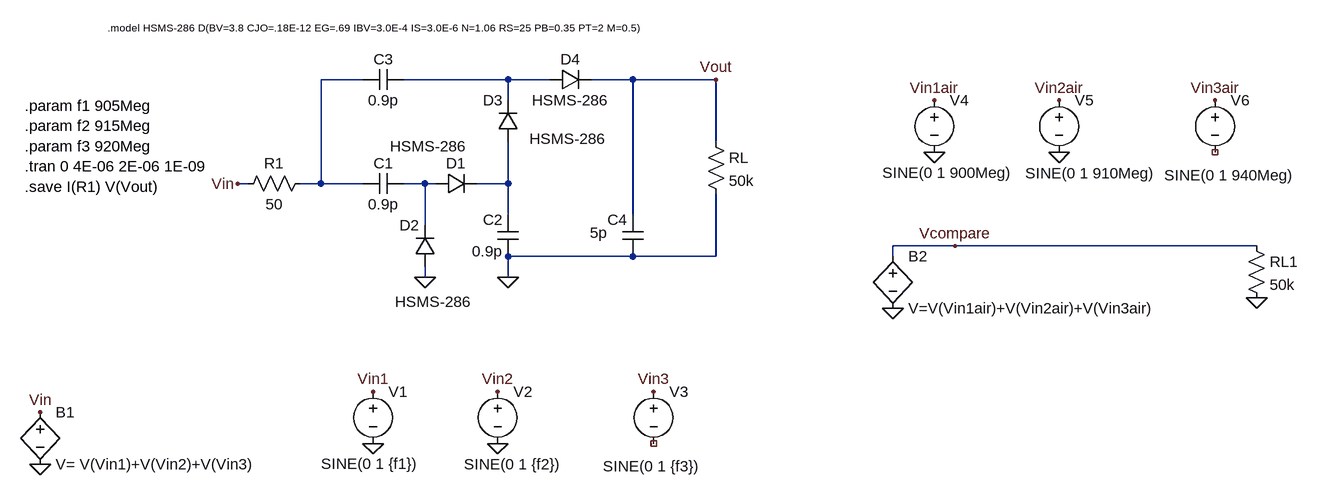
[diagram p0: schematic voltage_multiplier_2stage.asc]
voltage_multiplier_2stage.asc, the LTspice schematic file:
Version 4
SHEET 1 1536 736
WIRE 80 112 16 112
WIRE 304 112 144 112
WIRE 368 112 304 112
WIRE 496 112 432 112
WIRE 624 112 496 112
WIRE 304 144 304 112
WIRE 624 208 624 112
WIRE -96 272 -112 272
WIRE 16 272 16 112
WIRE 16 272 -16 272
WIRE 80 272 16 272
WIRE 176 272 144 272
WIRE 192 272 176 272
WIRE 304 272 304 208
WIRE 304 272 256 272
WIRE 304 320 304 272
WIRE 496 320 496 112
WIRE 176 336 176 272
WIRE 992 368 896 368
WIRE 1456 368 992 368
WIRE 496 384 304 384
WIRE 624 384 624 288
WIRE 624 384 496 384
WIRE 896 384 896 368
WIRE 176 416 176 400
WIRE 304 416 304 384
FLAG 304 416 0
FLAG 176 416 0
FLAG 96 592 Vin1
FLAG -112 272 Vin
FLAG 96 672 0
FLAG 288 672 0
FLAG -416 704 0
FLAG 288 592 Vin2
FLAG 528 592 Vin3
FLAG -416 624 Vin
FLAG 624 112 Vout
FLAG 960 144 Vin1air
FLAG 960 224 0
FLAG 1152 224 0
FLAG 1152 144 Vin2air
FLAG 1392 144 Vin3air
FLAG 896 464 0
FLAG 1456 448 0
FLAG 992 368 Vcompare
SYMBOL res 608 192 R0
SYMATTR InstName RL
SYMATTR Value 50k
SYMBOL cap 144 256 R90
WINDOW 0 0 32 VBottom 2
WINDOW 3 32 32 VTop 2
SYMATTR InstName C1
SYMATTR Value 0.9p
SYMBOL cap 320 384 R180
WINDOW 0 24 56 Left 2
WINDOW 3 24 8 Left 2
SYMATTR InstName C2
SYMATTR Value 0.9p
SYMBOL diode 192 288 R270
WINDOW 0 32 32 VTop 2
WINDOW 3 89 -11 VBottom 2
SYMATTR InstName D1
SYMATTR Value HSMS-286
SYMBOL diode 192 400 R180
WINDOW 0 24 64 Left 2
WINDOW 3 -56 -54 Left 2
SYMATTR InstName D2
SYMATTR Value HSMS-286
SYMBOL voltage 96 576 R0
WINDOW 3 -80 127 Left 2
SYMATTR Value SINE(0 1 {f1})
SYMATTR InstName V1
SYMBOL cap 144 96 R90
WINDOW 0 0 32 VBottom 2
WINDOW 3 32 32 VTop 2
SYMATTR InstName C3
SYMATTR Value 0.9p
SYMBOL cap 512 384 R180
WINDOW 0 24 56 Left 2
WINDOW 3 55 36 Left 2
SYMATTR InstName C4
SYMATTR Value 5p
SYMBOL diode 320 208 R180
WINDOW 0 24 64 Left 2
WINDOW 3 -135 5 Left 2
SYMATTR InstName D3
SYMATTR Value HSMS-286
SYMBOL diode 368 128 R270
WINDOW 0 32 32 VTop 2
WINDOW 3 0 32 VBottom 2
SYMATTR InstName D4
SYMATTR Value HSMS-286
SYMBOL voltage 288 576 R0
WINDOW 3 -52 128 Left 2
SYMATTR Value SINE(0 1 {f2})
SYMATTR InstName V2
SYMBOL bv -416 608 R0
SYMATTR InstName B1
SYMATTR Value V= V(Vin1)+V(Vin2)+V(Vin3)
SYMBOL voltage 528 576 R0
WINDOW 3 -78 131 Left 2
SYMATTR Value SINE(0 1 {f3})
SYMATTR InstName V3
SYMBOL bv 896 368 R0
SYMATTR InstName B2
SYMATTR Value V=V(Vin1air)+V(Vin2air)+V(Vin3air)
SYMBOL voltage 960 128 R0
WINDOW 3 -80 127 Left 2
SYMATTR Value SINE(0 1 900Meg)
SYMATTR InstName V4
SYMBOL voltage 1152 128 R0
WINDOW 3 -52 128 Left 2
SYMATTR Value SINE(0 1 910Meg)
SYMATTR InstName V5
SYMBOL voltage 1392 128 R0
WINDOW 3 -78 131 Left 2
SYMATTR Value SINE(0 1 940Meg)
SYMATTR InstName V6
SYMBOL res 1440 352 R0
SYMATTR InstName RL1
SYMATTR Value 50k
SYMBOL res 0 256 R90
WINDOW 0 0 56 VBottom 2
WINDOW 3 32 56 VTop 2
SYMATTR InstName R1
SYMATTR Value 50
TEXT -440 152 Left 2 !.param f1 905Meg\n.param f2 915Meg\n.param f3 920Meg\n.tran 0 4E-06 2E-06 1E-09\n.save I(R1) V(Vout)
TEXT -312 32 Left 1 !.model HSMS-286 D(BV=3.8 CJO=.18E-12 EG=.69 IBV=3.0E-4 IS=3.0E-6 N=1.06 RS=25 PB=0.35 PT=2 M=0.5)

The netlist it stands for:
* voltage_multiplier_2stage.asc
RL Vout 0 50k
C1 N003 N001 0.9p
C2 0 N004 0.9p
D1 N003 N004 HSMS-286
D2 0 N003 HSMS-286
V1 Vin1 0 SINE(0 1 {f1})
C3 N002 N001 0.9p
C4 0 Vout 5p
D3 N004 N002 HSMS-286
D4 N002 Vout HSMS-286
V2 Vin2 0 SINE(0 1 {f2})
B1 Vin 0 V= V(Vin1)+V(Vin2)+V(Vin3)
V3 Vin3 NC_01 SINE(0 1 {f3})
B2 Vcompare 0 V=V(Vin1air)+V(Vin2air)+V(Vin3air)
V4 Vin1air 0 SINE(0 1 900Meg)
V5 Vin2air 0 SINE(0 1 910Meg)
V6 Vin3air NC_02 SINE(0 1 940Meg)
RL1 Vcompare 0 50k
R1 N001 Vin 50
.model D D
.lib standard.dio
.param f1 905Meg
.param f2 915Meg
.param f3 920Meg
.tran 0 4E-06 2E-06 1E-09
.save I(R1) V(Vout)
.model HSMS-286 D(BV=3.8 CJO=.18E-12 EG=.69 IBV=3.0E-4 IS=3.0E-6 N=1.06 RS=25 PB=0.35 PT=2 M=0.5)
.backanno
.end